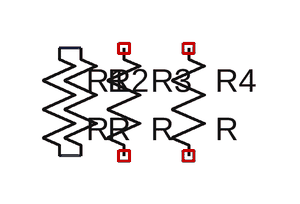
[diagram p0: schematic Draft2.asc]
Draft2.asc, the LTspice schematic file:
Version 4
SHEET 1 880 680
WIRE 48 96 32 96
WIRE 48 176 32 176
SYMBOL res 16 80 R0
SYMATTR InstName R1
SYMBOL res 32 80 R0
SYMATTR InstName R2
SYMBOL res 64 80 R0
SYMATTR InstName R3
SYMBOL res 112 80 R0
SYMATTR InstName R4

The netlist it stands for:
* Draft2.asc
R1 N001 N002 R
R2 N001 N002 R
R3 NC_01 NC_02 R
R4 NC_03 NC_04 R
.backanno
.end